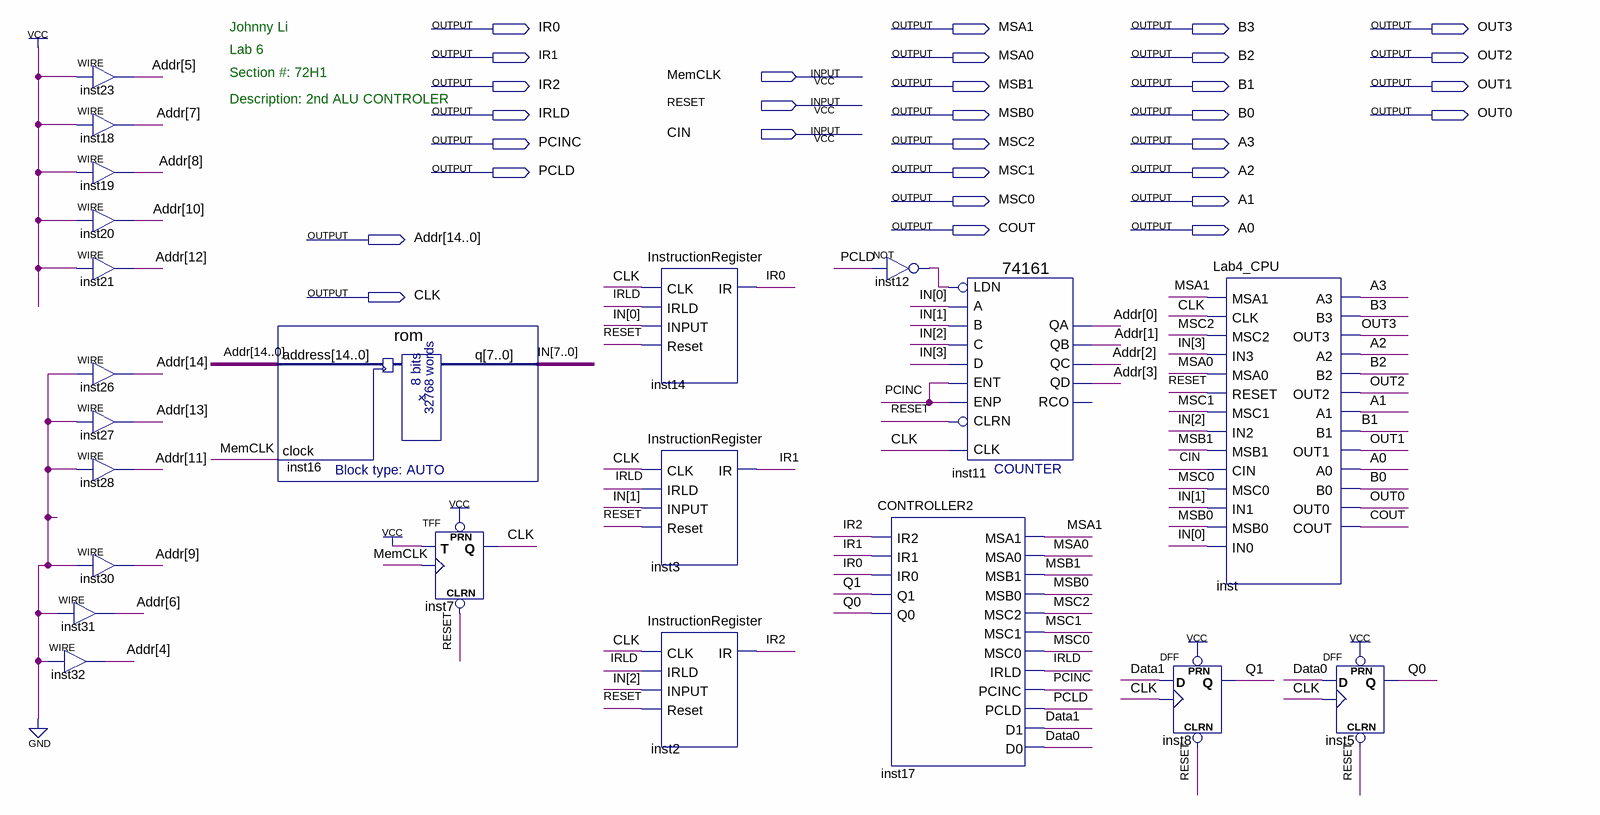
[diagram p0: schematic sheet]
// Quartus schematic LAB6_Part2.bdf as structural Verilog: 22 symbols, 31 pins
module LAB6_Part2 (
  input  MemCLK,
  input  RESET,
  input  CIN,
  output IR0,
  output MSA1,
  output B3,
  output OUT3,
  output IR1,
  output MSA0,
  output B2,
  output OUT2,
  output IR2,
  output MSB1,
  output B1,
  output OUT1,
  output IRLD,
  output MSB0,
  output B0,
  output OUT0,
  output PCINC,
  output MSC2,
  output A3,
  output PCLD,
  output MSC1,
  output A2,
  output MSC0,
  output A1,
  output COUT,
  output A0,
  output [14:0] Addr,
  output CLK
);

  wire Data0, Data1, inst12_out, Q0, Q1;
  wire [7:0] IN;

  assign Addr[5] = 1'b1;  // WIRE inst23
  assign Addr[7] = 1'b1;  // WIRE inst18
  assign Addr[8] = 1'b1;  // WIRE inst19
  assign Addr[10] = 1'b1;  // WIRE inst20
  assign Addr[12] = 1'b1;  // WIRE inst21
  assign Addr[14] = 1'b0;  // WIRE inst26
  assign Addr[13] = 1'b0;  // WIRE inst27
  assign Addr[11] = 1'b0;  // WIRE inst28
  assign Addr[9] = 1'b0;  // WIRE inst30
  assign Addr[6] = 1'b0;  // WIRE inst31
  assign Addr[4] = 1'b0;  // WIRE inst32
  rom inst16 (.address(Addr), .clock(MemCLK), .q(IN));
  TFF inst7 (.PRN(1'b1), .CLRN(RESET), .T(1'b1), .CLK(MemCLK), .Q(CLK));
  InstructionRegister inst14 (.CLK(CLK), .IRLD(IRLD), .INPUT(IN[0]), .Reset(RESET), .IR(IR0));
  InstructionRegister inst3 (.CLK(CLK), .IRLD(IRLD), .INPUT(IN[1]), .Reset(RESET), .IR(IR1));
  InstructionRegister inst2 (.CLK(CLK), .IRLD(IRLD), .INPUT(IN[2]), .Reset(RESET), .IR(IR2));
  not inst12 (inst12_out, PCLD);
  CONTROLLER2 inst17 (
    .IR2(IR2), .IR1(IR1), .IR0(IR0), .Q1(Q1), .Q0(Q0), .MSA1(MSA1), .MSA0(MSA0), .MSB1(MSB1), .MSB0(MSB0),
    .MSC2(MSC2), .MSC1(MSC1), .MSC0(MSC0), .IRLD(IRLD), .PCINC(PCINC), .PCLD(PCLD), .D1(Data1), .D0(Data0));
  \74161  inst11 (
    .CLRN(RESET), .CLK(CLK), .ENP(PCINC), .LDN(inst12_out), .A(IN[0]), .D(IN[3]), .ENT(PCINC), .B(IN[1]),
    .C(IN[2]), .QD(Addr[3]), .QC(Addr[2]), .QB(Addr[1]), .QA(Addr[0]));  // open: RCO
  DFF inst8 (.CLRN(RESET), .CLK(CLK), .D(Data1), .PRN(1'b1), .Q(Q1));
  Lab4_CPU inst (
    .MSA1(MSA1), .CLK(CLK), .MSC2(MSC2), .IN3(IN[3]), .MSA0(MSA0), .RESET(RESET), .MSC1(MSC1), .IN2(IN[2]),
    .MSB1(MSB1), .CIN(CIN), .MSC0(MSC0), .IN1(IN[1]), .MSB0(MSB0), .IN0(IN[0]), .A3(A3), .B3(B3),
    .OUT3(OUT3), .A2(A2), .B2(B2), .OUT2(OUT2), .A1(A1), .B1(B1), .OUT1(OUT1), .A0(A0), .B0(B0), .OUT0(OUT0),
    .COUT(COUT));
  DFF inst5 (.CLRN(RESET), .CLK(CLK), .D(Data0), .PRN(1'b1), .Q(Q0));

  // Notes on the sheet:
  //   Johnny Li 
  //   Lab 6 
  //   Section #: 72H1
  //   Description: 2nd ALU CONTROLER
endmodule
